# EasyEDA Pro project Usb_Hub.epro

# Schematic Schematic1
Board Name: Board1; Create Date: 2026-04-14; Page Name: P1; Project Name: Usb_Hub; Schematic Name: Schematic1; Update Date: 2026-04-15; Company: EasyEDA.com; Page Size: A4; Version: V1.0
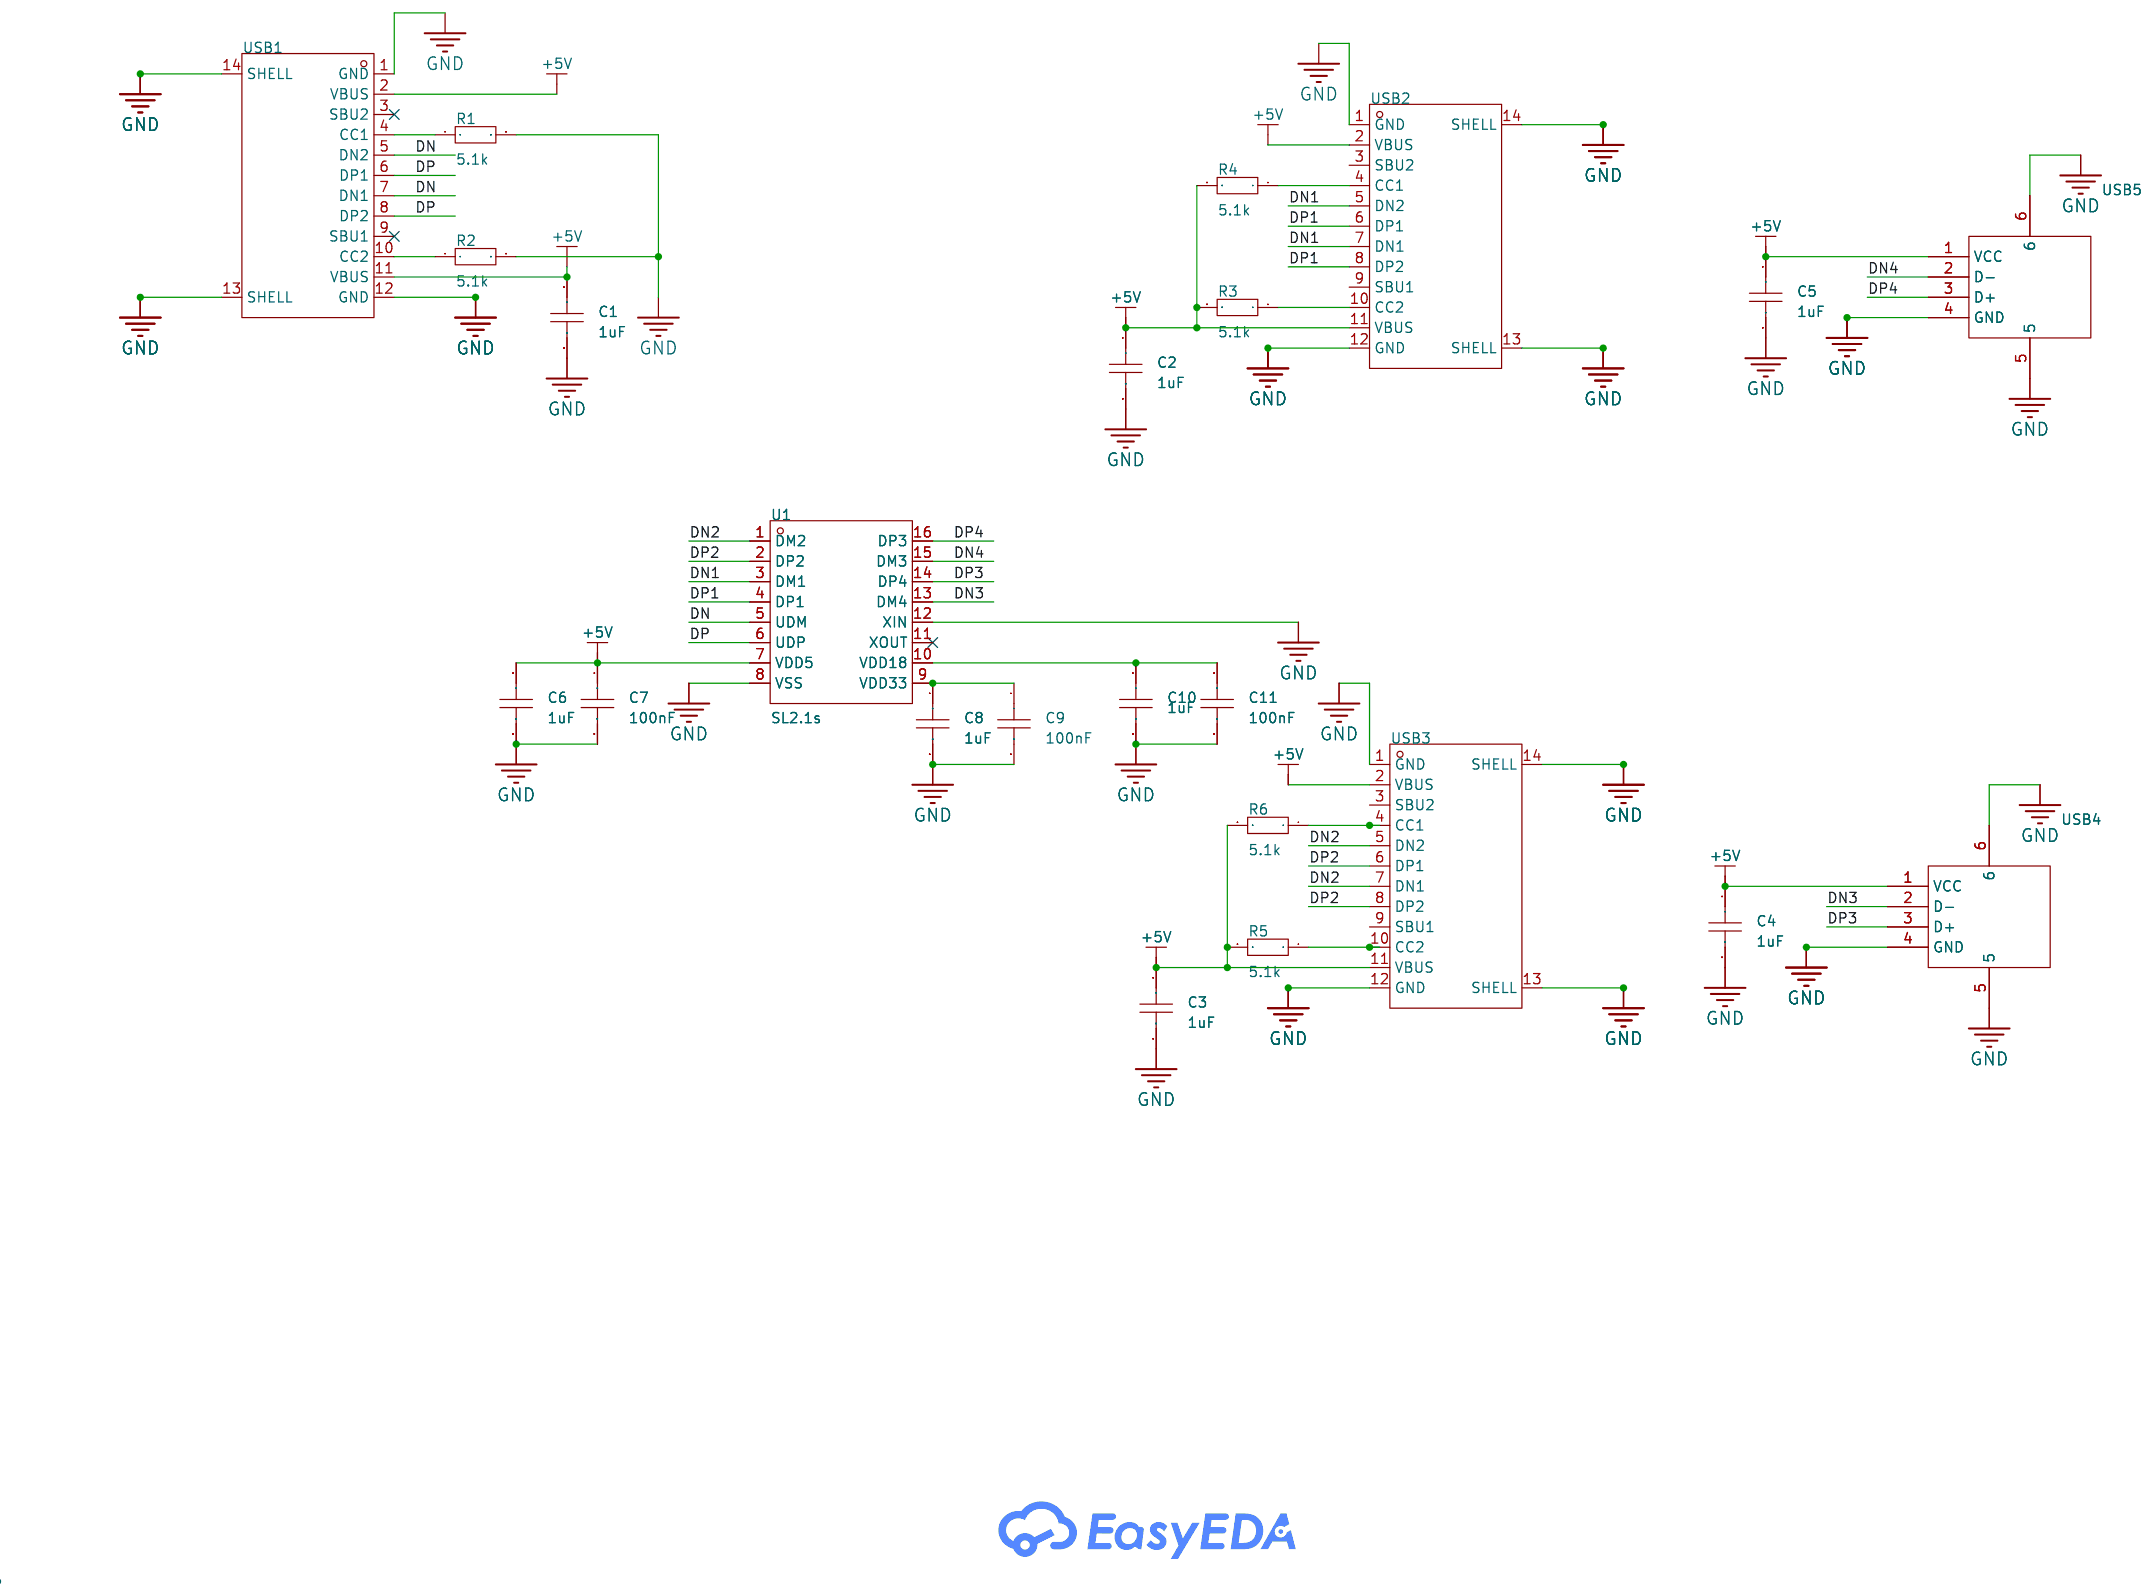
[diagram p0: schematic sheet]

## Parts
C1  1uF  [C0603]
C2  1uF  [C0603]
C3  1uF  [C0603]
C4  1uF  [C0603]
C5  1uF  [C0603]
C6  1uF  [C0603]
C7  100nF  [C0603]
C8  1uF  [C0603]
C9  100nF  [C0603]
C10  1uF  [C0603]
C11  100nF  [C0603]
R1  5.1k  [R0603]
R2  5.1k  [R0603]
R3  5.1k  [R0603]
R4  5.1k  [R0603]
R5  5.1k  [R0603]
R6  5.1k  [R0603]
U1  SL2.1s  [SSOP-16_L4.6-W2.6-P0.53-LS4.0-BL]
USB1  TYPE-C 16PIN 2MD(073)  [USB-C-SMD_TYPE-C-6PIN-2MD-073]
USB2  TYPE-C 16PIN 2MD(073)  [USB-C-SMD_TYPE-C-6PIN-2MD-073]
USB3  TYPE-C 16PIN 2MD(073)  [USB-C-SMD_TYPE-C-6PIN-2MD-073]
USB4  10.0 QHHTZB6.3  [USB-A-TH_10.0QHHTZB6.3]
USB5  10.0 QHHTZB6.3  [USB-A-TH_10.0QHHTZB6.3]

## Library data of the parts
C1-C11 = CAP_0603: Supplier Footprint: 0603
R1-R6 = Res_0603: Supplier Footprint: 0603
U1 = SL2.1s: type:Hub USB Protocol:USB 2.0 Data Rate:- Voltage - Supply:4V~5.25V Voltage - Supply:4V~5.25V Operating Temperature:0℃~+70℃ Operating Temperature:0℃~+70℃ Memory Interface:- Current - Supply:120mA Quiescent Supply Current:2.5mA Number of Channels:4; LCSC Part Name: USB2.0 HUB控制器集成电路; Supplier Part: C2684433; Manufacturer: CoreChips(和芯润德); Supplier Footprint: SSOP-16; JLCPCB Part Class: Extended Part; Datasheet: https://item.szlcsc.com/datasheet/SL2.1s/2782346.html; Supplier: LCSC; type: Hub; USB Protocol: USB 2.0; Voltage - Supply: 4V~5.25V; Operating Temperature: 0℃~+70℃; Current - Supply: 120mA; Quiescent Supply Current: 2.5mA; Number of Channels: 4
USB1-USB3 = TYPE-C 16PIN 2MD(073): Connector Type:Type-C Protocol Standard:- Gender:Female Mounting Type:Surface Mount, Right Angle Number of Contacts:16P Number of Ports:1 Current Rating-Power:3A Voltage Rating:5V Connect-Disconnect Life:10,000 Cycles Supplementary Features:- Center Heigh; LCSC Part Name: Type-C 母 卧贴; Supplier Part: C2765186; Manufacturer: SHOU HAN(首韩); Supplier Footprint: SMD; JLCPCB Part Class: Extended Part; Datasheet: https://item.szlcsc.com/datasheet/TYPE-C%252016PIN%25202MD(073)/2901843.html; Supplier: LCSC; Connector Type: Type-C; Gender: Female; Mounting Type: Surface Mount, Right Angle; Number of Contacts: 16P; Number of Ports: 1; Current Rating-Power: 3A; Voltage Rating: 5V; Connect-Disconnect Life: 10,000 Cycles; Detection color: Black; Operating Temperature: -25℃~+85℃
USB4 USB5 = 10.0 QHHTZB6.3: Connector Type:Type-A Protocol Standard:USB 2.0 Gender:Female Mounting Type:Surface Mount, Right Angle Number of Contacts:4P Number of Ports:1 Current Rating-Power:1.5A Voltage Rating:30V Connect-Disconnect Life:5,000 times Supplementary Features:- Center; LCSC Part Name: 壳长10.0mm; Supplier Part: C668591; Manufacturer: SHOU HAN(首韩); Supplier Footprint: SMD; JLCPCB Part Class: Extended Part; Datasheet: https://item.szlcsc.com/datasheet/10.0%2520QHHTZB6.3/698534.html; Supplier: LCSC; Connector Type: Type-A; Protocol Standard: USB 2.0; Gender: Female; Mounting Type: Surface Mount, Right Angle; Number of Contacts: 4P; Number of Ports: 1; Current Rating-Power: 1.5A; Voltage Rating: 30V; Connect-Disconnect Life: 5,000 times; Length: 10mm; Detection color: Black; Operating Temperature: -25℃~+85℃

## Nets
+5V: C1.1 C2.1 C3.1 C4.1 C5.1 C6.1 C7.1 R3.2 R4.2 R5.2 R6.2 U1.7(VDD5) USB1.2(VBUS) USB1.11(VBUS) USB2.2(VBUS) USB2.11(VBUS) USB3.2(VBUS) USB3.11(VBUS) USB4.1(VCC) USB5.1(VCC)
GND: C1.2 C2.2 C3.2 C4.2 C5.2 C6.2 C7.2 C8.2 C9.2 C10.2 C11.2 R1.2 R2.2 U1.8(VSS) U1.12(XIN) USB1.1(GND) USB1.12(GND) USB1.13(SHELL) USB1.14(SHELL) USB2.1(GND) USB2.12(GND) USB2.13(SHELL) USB2.14(SHELL) USB3.1(GND) USB3.12(GND) USB3.13(SHELL) USB3.14(SHELL) USB4.4(GND) USB4.5 USB4.6 USB5.4(GND) USB5.5 USB5.6
DN: U1.5(UDM) USB1.5(DN2) USB1.7(DN1)
DN1: U1.3(DM1) USB2.5(DN2) USB2.7(DN1)
DN2: U1.1(DM2) USB3.5(DN2) USB3.7(DN1)
DN3: U1.13(DM4) USB4.2(D-)
DN4: U1.15(DM3) USB5.2(D-)
DP: U1.6(UDP) USB1.6(DP1) USB1.8(DP2)
DP1: U1.4(DP1) USB2.6(DP1) USB2.8(DP2)
DP2: U1.2(DP2) USB3.6(DP1) USB3.8(DP2)
DP3: U1.14(DP4) USB4.3(D+)
DP4: U1.16(DP3) USB5.3(D+)
$1N2103: R1.1 USB1.4(CC1)
$1N2117: R2.1 USB1.10(CC2)
$1N2520: R4.1 USB2.4(CC1)
$1N2524: R3.1 USB2.10(CC2)
$1N2586: R5.1 USB3.10(CC2)
$1N2588: R6.1 USB3.4(CC1)
$1N3036: C8.1 C9.1 U1.9(VDD33)
$1N3110: C10.1 C11.1 U1.10(VDD18)

Not connected (* = marked no-connect by the designer): U1 11(XOUT)*; USB1 3(SBU2)* 9(SBU1)*; USB2 3(SBU2) 9(SBU1); USB3 3(SBU2) 9(SBU1)

# Board PCB1
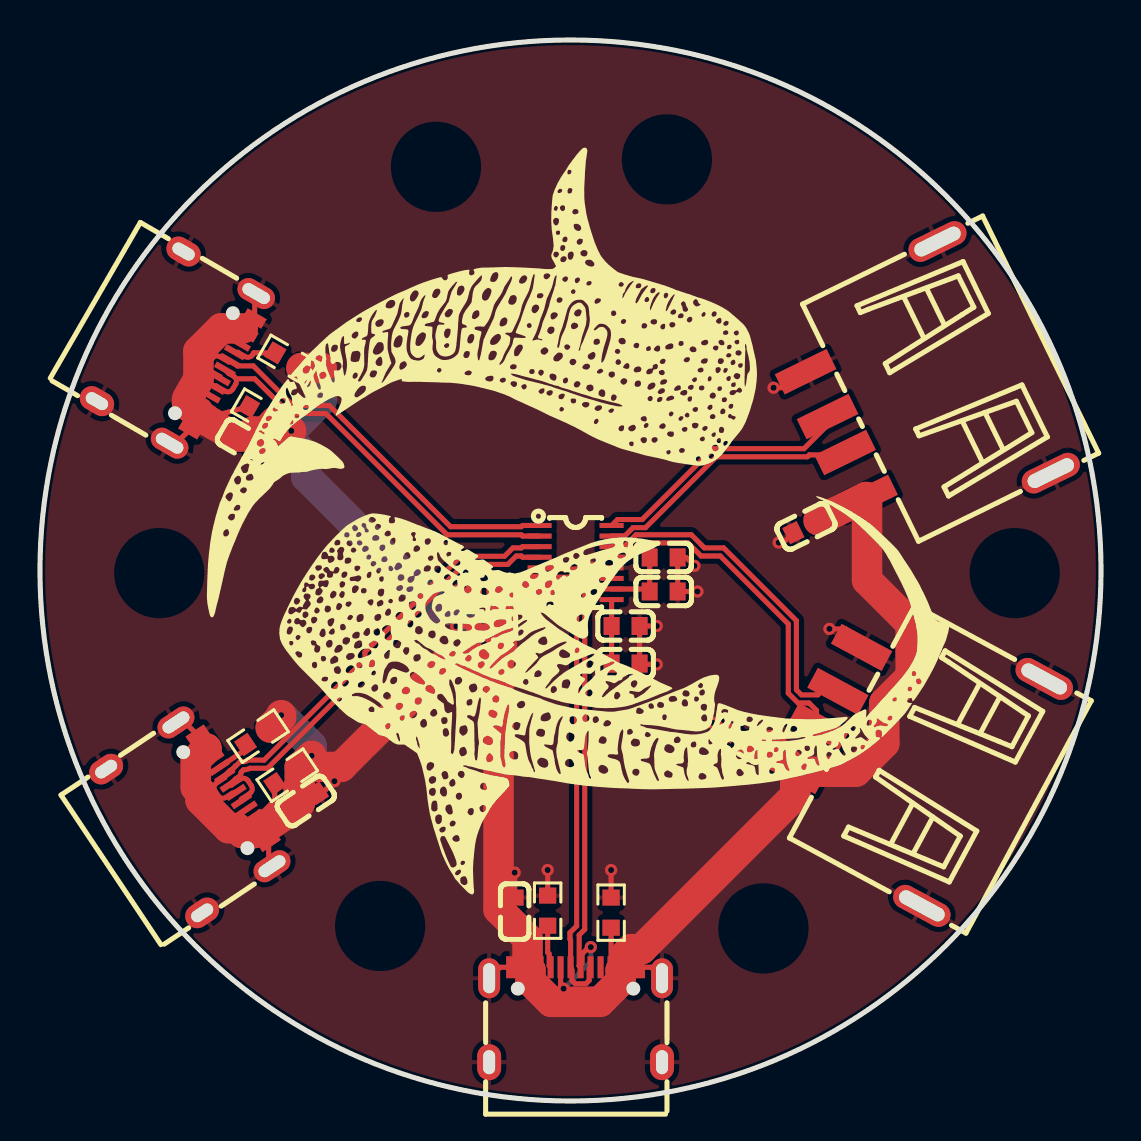
[diagram p1: board, top side]
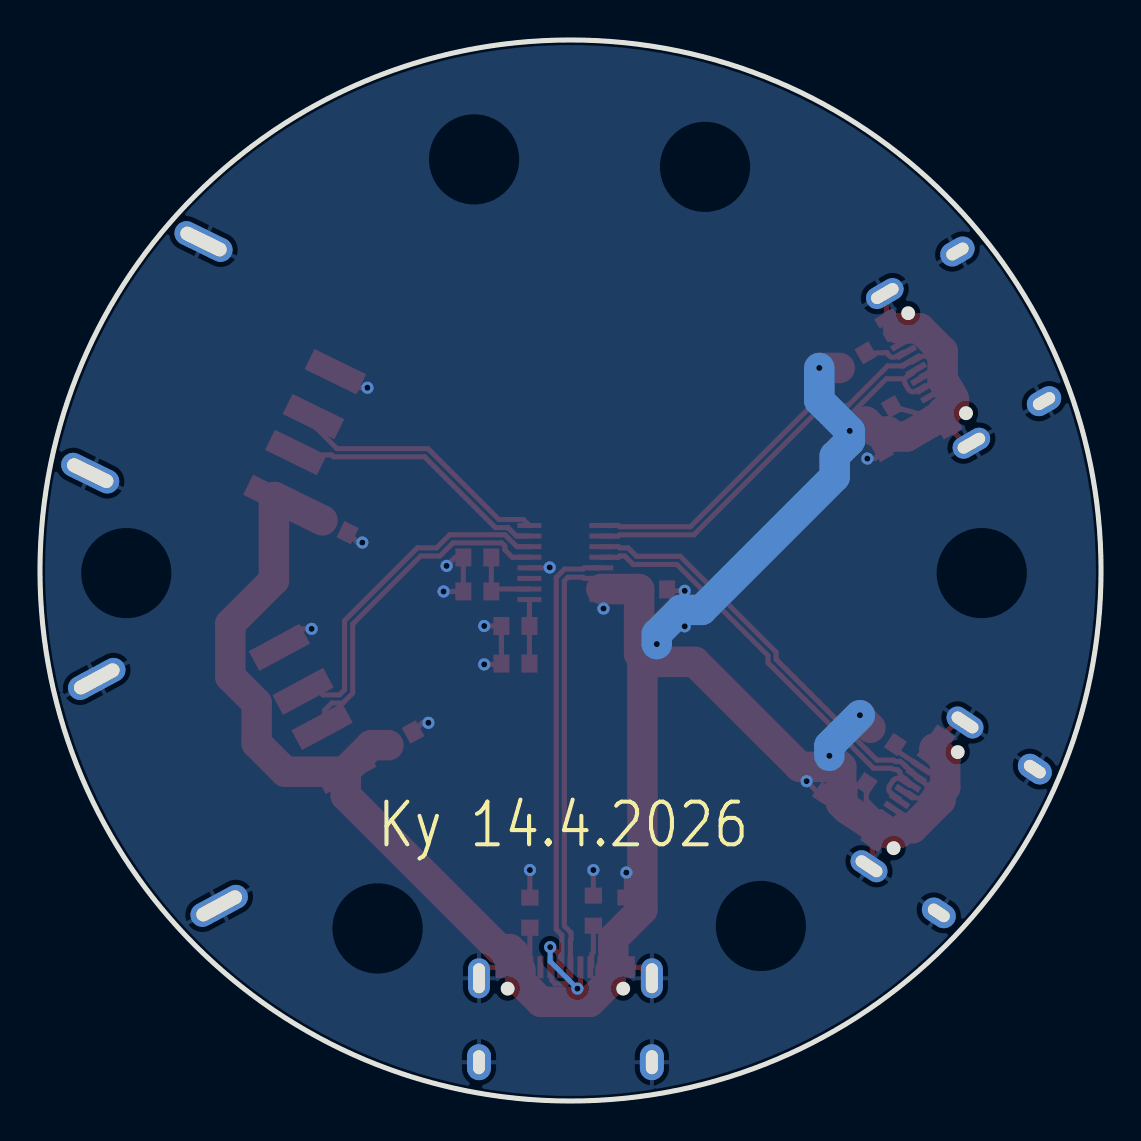
[diagram p2: board, bottom side, seen from below]

Outline 53.09 x 53.09 mm; copper layers: Top Layer, Bottom Layer. Coordinates in mm from the lower left corner of the outline.
Outline path: circle c26.54,26.54 r26.54
Stack: Top Layer 0.035mm / Dielectric1 1.51mm FR4 er 4.5 / Bottom Layer 0.035mm

## Design rules (mm)
net DN2: DP5
net DP2: DP5
net DN1: DP2
net DP1: DP2
net DN: DP1
net DP: DP1
net DN4: DP4
net DP4: DP4
net DN3: DP3
net DP3: DP3
template: Custom Config
spacing copperThickness1oz (default): track to track 0.102, other pairs 0.152 to 0.3
spacing copperThickness2oz: track to track 0.203, other pairs 0.152 to 0.3
track width copperThickness1oz (default): min 0.127, default 0.254, max 2.54
track width copperThickness2oz: min 0.203, default 0.254, max 2.54
differential pair differentialPair (default): width min 0.127, default 0.254, max 2.54; gap min 0.152, default 0.152
via viaSize (default): diameter min 0.5, default 0.61, max 10; hole min 0.3, default 0.305, max 6.3

## Placement (name value [footprint] x y rotation side)
C1  1uF  [C0603]  23.75 9.48 90 top
C2  1uF  [C0603]  13.3 15.01 33.7 top
C3  1uF  [C0603]  10.32 32.9 329.9 top
C4  1uF  [C0603]  35.04 18.13 151.7 top
C5  1uF  [C0603]  38.32 28.74 206.1 top
C6  1uF  [C0603]  22.41 23.77 180 top
C7  100nF  [C0603]  22.41 25.6 180 top
C8  1uF  [C0603]  29.3 21.88 0 top
C9  100nF  [C0603]  29.3 23.77 0 top
C10  1uF  [C0603]  31.2 27.2 0 top
C11  100nF  [C0603]  31.2 25.49 0 top
R1  5.1k  [R0603]  25.4 9.52 90 top
R2  5.1k  [R0603]  28.58 9.42 90 top
R3  5.1k  [R0603]  12.37 16.3 33.7 top
R4  5.1k  [R0603]  10.91 18.26 33.7 top
R5  5.1k  [R0603]  11.11 34.36 329.9 top
R6  5.1k  [R0603]  12.42 37.05 329.9 top
U1  SL2.1s  [SSOP-16_L4.6-W2.6-P0.53-LS4.0-BL]  26.8 26.94 270 top
USB1  TYPE-C 16PIN 2MD(073)  [USB-C-SMD_TYPE-C-6PIN-2MD-073]  26.8 4.32 0 top
USB2  TYPE-C 16PIN 2MD(073)  [USB-C-SMD_TYPE-C-6PIN-2MD-073]  7.69 14.33 303.7 top
USB3  TYPE-C 16PIN 2MD(073)  [USB-C-SMD_TYPE-C-6PIN-2MD-073]  7.07 37.57 239.9 top
USB4  10.0 QHHTZB6.3  [USB-A-TH_10.0QHHTZB6.3]  43.31 17.53 61.7 top
USB5  10.0 QHHTZB6.3  [USB-A-TH_10.0QHHTZB6.3]  43.79 35.28 116.1 top

## Footprints (pads in the part's own frame, mm; a bottom-side part is the same pattern mirrored in y, then rotated)
C0603
  rect 0.8x0.9 smd: 1(-0.7,0) 2(0.7,0)
R0603
  rect 0.806x0.864 smd: 1(-0.753,0) 2(0.753,0)
SSOP-16_L4.6-W2.6-P0.53-LS4.0-BL
  rect 0.25x1.2 smd: 1(-1.855,-1.8) 2(-1.325,-1.8) 3(-0.795,-1.8) 4(-0.265,-1.8) 5(0.265,-1.8) 6(0.795,-1.8) 7(1.325,-1.8) 8(1.855,-1.8) 9(1.855,1.8) 10(1.325,1.8) 11(0.795,1.8) 12(0.265,1.8) 13(-0.265,1.8) 14(-0.795,1.8) 15(-1.325,1.8) 16(-1.855,1.8)
USB-A-TH_10.0QHHTZB6.3
  rect 1.12x2.88 smd: 1(-3.5,4.395) 2(-1,4.395) 3(1,4.395) 4(3.5,4.395)
  oval 1.2x3.1 hole 0.7x2.5: 5(-6.45,-4.395) 6(6.45,-4.395)
USB-C-SMD_TYPE-C-6PIN-2MD-073
  rect 0.55x1.1 smd: 1(-3.2,2.375) 2(-2.4,2.375) 11(2.4,2.375) 12(3.2,2.375)
  rect 0.3x1.1 smd: 3(-1.75,2.375) 4(-1.25,2.375) 5(-0.75,2.375) 6(-0.25,2.375) 7(0.25,2.375) 8(0.75,2.375) 9(1.25,2.375) 10(1.75,2.375)
  oval 1.1x2 hole 0.6x1.5: 13(-4.325,1.825) 14(4.325,1.825)
  oval 1.2x1.8 hole 0.6x1.2: 13(-4.325,-2.375) 14(4.325,-2.375)

## Nets
As in the schematic.

Pads without a net: U1 11; USB1 3 9; USB2 3 9; USB3 3 9

## Via types
v1: diameter 0.61, hole 0.305, Top Layer to Bottom Layer, 24 vias

## Routing (per net, layer and track width the routed paths; a pad name or vN(x,y) marks a point on that pad's centre or on a via; arc(x,y) is an arc through that point)
+5V: length 126
  Top Layer w1.524: USB4.1 37.79,15.28 30.1,7.6 29.58,7.6 29.37,7.39 29.37,6.86 USB1.11 29.05,6.55 29.05,6 28.02,4.96 25.58,4.96 24.54,6 24.54,6.55 USB1.2 24.4,8.13 C1.1 22.94,9.58 22.94,22.22 ; USB4.1 37.84,16.48 40.82,16.48 42.25,17.9 42.25,19.92 43.56,21.23 43.56,23.88 41.38,26.06 USB5.1 41.33,30.22 38.95,29.05 ; USB4.1 36.52,17.8 C4.1 ; 10.96,13.65 10.71,13.41 10.11,13.41 9.87,13.65 9.43,13.65 8.03,15.05 8.03,15.46 7.8,15.69 7.8,17.07 8.33,17.6 USB2.2 ; 22.94,22.22 23.11,22.38 23.11,23.24 ; 22.94,22.22 22.7,21.97 20.32,21.97 15.07,16.72 13.04,16.72 ; 13.04,16.72 R3.2 13,15.75 12.95,15.7 12.95,15.16 13,15.1 13,14.9 C2.1 11.21,13.61 ; 13.04,16.72 v1(13.59,17.27) ; v1(12.07,19.3) 12.07,19.2 R4.2 ; U1.7 23.13,25.62 C7.1 C6.1 23.11,23.24 ; 23.11,23.24 22.6,23.24 v1(22.23,22.86) ; USB3.11 7.93,34.47 7.52,34.7 arc(7.36,34.92) 7.39,35.19 7.54,35.45 arc(7.57,35.49) 7.61,35.53 arc(7.62,35.58) 7.64,35.62 7.79,35.88 arc(7.82,35.92) 7.86,35.96 arc(7.87,36.01) 7.89,36.05 7.93,36.11 7.93,37.52 9.06,38.65 10.15,38.65 ; v1(12.57,33.53) 12.22,33.53 R5.2 11.26,33.49 10.66,33.49 10.41,33.25 9.71,33.25 8.22,34.11 ; 13.07,36.68 v1(14.1,36.68)
  Bottom Layer w1.524: v1(14.1,36.68) 14.1,35.05 v1(12.57,33.53) 12.57,33.02 13.32,32.27 13.32,31.23 19.98,24.57 21.02,24.57 22.23,23.37 v1(22.23,22.86) ; v1(12.07,19.3) 13.59,17.78 v1(13.59,17.27)
GND: length 31.2
  Top Layer w0.254: C4.2 33.96,18.92 v1(33.66,18.92) ; v1(32.74,26.77) 32.32,27.2 C10.2 C11.2 v1(32.89,25.49) ; 22.47,6.14 23.02,6.69 USB1.1 ; USB2.12 11.44,11.91 USB2.14 ; v1(30.86,23.77) C9.2 C8.2 30.04,21.84 v1(30.86,21.84) ; 31.12,6.14 30.57,6.69 USB1.12 ; v1(20.83,25.53) 21.64,25.53 C7.2 ; U1.8 25,24.74 v1(24.89,24.64) ; U1.12 27.6,26.68 v1(27.58,26.69) ; v1(39.5,23.62) 40.31,23.62 41.74,22.19 ; USB5.4 37.5,35.69 v1(36.7,35.69) ; USB3.1 10.76,40.34 ; USB2.13 7.26,18.94 USB2.1 ; R1.2 v1(25.4,11.56) ; R2.2 v1(28.58,11.56) ; C2.2 14.13,15.4 v1(14.73,16) ; 10.93,32.55 11.31,32.15 v1(11.69,32.14) ; 10.58,40.56 10.64,40.62 ; C6.2 21.68,23.75 v1(20.83,23.75) ; C5.2 37.2,27.94 v1(36.96,27.94) ; USB3.14 6.79,32.91 USB3.12 ; C1.2 v1(23.75,11.43)
DN: length 27.1
  Top Layer w0.254: 26.98,6.76 USB1.7 ; 26.98,6.76 26.98,8.31 27.26,8.59 27.26,26.2 26.84,26.61 25.91,26.61 25.85,26.68 U1.5 ; 26.98,6.76 27.12,6.91 27.12,7.36 27.46,7.7 v1(27.56,7.7) ; USB1.5 26.05,5.77 v1(26.2,5.62)
  Bottom Layer w0.254: v1(26.2,5.62) 27.56,6.98 v1(27.56,7.7)
DN1: length 23
  Top Layer w0.254: USB2.7 9.79,15.46 arc(9.7,15.42) 9.61,15.4 9.31,15.19 arc(9.1,15.15) 8.92,15.27 8.75,15.52 arc(8.71,15.73) 8.83,15.91 9.25,16.19 USB2.5 9.5,16.53 9.67,16.64 arc(9.72,16.69) 9.77,16.76 9.79,16.76 9.97,16.94 10.07,17 arc(10.21,16.98) 10.34,17.02 10.39,17.05 11.21,17.05 16.26,22.1 16.26,22.46 21.06,27.26 23.24,27.26 23.66,27.67 24.08,27.67 24.15,27.74 U1.3
DN2: length 20.9
  Top Layer w0.254: USB3.5 9.45,36.98 8.99,37.24 arc(8.78,37.27) 8.61,37.14 8.46,36.88 arc(8.43,36.67) 8.56,36.5 9.01,36.24 USB3.7 ; U1.1 24.15,28.8 24.08,28.73 20.54,28.73 14.48,34.8 12.65,34.8 10.67,36.78 9.87,36.78
DN3: length 17
  Top Layer w0.254: USB4.2 38.85,18.85 38.85,19.54 38.48,19.91 37.93,19.91 37.44,20.41 37.44,23.86 34.04,27.27 33.08,27.27 32.42,27.92 29.99,27.92 29.83,27.76 29.83,27.58 29.45,27.21 U1.13
DN4: length 13.4
  Top Layer w0.254: USB5.2 40.16,32.33 38.49,32.33 38.4,32.23 33.84,32.23 30.3,28.69 29.67,28.69 29.25,28.27 U1.15
DP: length 23.8
  Top Layer w0.254: U1.6 25.85,26.15 25.91,26.21 26.67,26.21 26.85,26.03 26.85,8.76 26.52,8.42 26.52,8.09 26.55,8.06 USB1.6 26.57,6.67 26.57,6.6 26.62,6.55 26.62,6.03 26.78,5.86 27.31,5.86 27.48,6.03 27.48,6.62 USB1.8
DP1: length 22.8
  Top Layer w0.254: U1.4 24.15,27.21 24.08,27.27 23.83,27.27 23.41,26.85 21.22,26.85 16.66,22.29 16.66,21.93 11.38,16.65 10.51,16.65 arc(10.35,16.59) 10.18,16.57 10.07,16.46 arc(10.04,16.32) 9.94,16.22 9.78,16.11 USB2.6 9.58,15.8 10.02,16.1 arc(10.23,16.14) 10.41,16.03 10.58,15.78 arc(10.62,15.57) 10.5,15.39 10.08,15.11 USB2.8
DP2: length 20.7
  Top Layer w0.254: USB3.8 8.81,35.78 9.26,35.52 arc(9.48,35.49) 9.65,35.62 9.8,35.88 arc(9.83,35.96) 9.83,36.05 ; 9.83,36.13 10.74,36.13 12.49,34.39 14.31,34.39 20.37,28.33 24.08,28.33 24.15,28.27 U1.2 ; USB3.6 9.45,36.4 9.69,36.26 arc(9.78,36.18) 9.83,36.08
DP3: length 17.1
  Top Layer w0.254: U1.14 29.23,27.74 29.82,28.33 32.59,28.33 33.24,27.67 34.2,27.67 37.85,24.03 37.85,20.57 38.1,20.32 38.92,20.32 39.21,20.61 39.8,20.61 USB4.3
DP4: length 13.3
  Top Layer w0.254: USB5.3 39.28,34.12 39.28,33.7 38.23,32.64 33.67,32.64 30.13,29.09 28.9,29.09 U1.16
$1N2103: length 2.1
  Top Layer w0.254: R1.1 25.4,7.43 25.48,7.36 25.48,6.76 USB1.4
$1N2117: length 2
  Top Layer w0.254: USB1.10 28.58,6.72 R2.1
$1N2520: length 1.9
  Top Layer w0.254: USB2.4 8.97,16.7 10.51,17.73
$1N2524: length 1.9
  Top Layer w0.254: 10.97,14.46 11.16,14.46 11.75,15.05 R3.1
$1N2586: length 2.4
  Top Layer w0.254: R5.1 9.09,34.38 8.25,34.86
$1N2588: length 2.2
  Top Layer w0.254: R6.1 11.76,37.42 10.7,37.44 10.65,37.35 arc(10.48,37.22) 10.27,37.25 9.9,37.46 USB3.4
$1N3036: length 3.2
  Top Layer w0.254: U1.9 28.6,23.77 ; C9.1 C8.1
$1N3110: length 3.7
  Top Layer w0.254: C10.1 C11.1 30.38,25.62 U1.10

## Copper pours and planes (outline as drawn; the poured copper is in the pictures)
GND on Top Layer: -4.44,55.75 55.5,55.75 55.5,-1.91 -4.44,-1.91
GND on Bottom Layer: -8.13,56.26 62.87,56.26 62.87,-3.05 -8.13,-3.05

## Text on the board
Bottom Silkscreen Layer: Ky 14.4.2026
